# Altium schematic sheet 20A_3V3_EVB.SchDoc
size A4
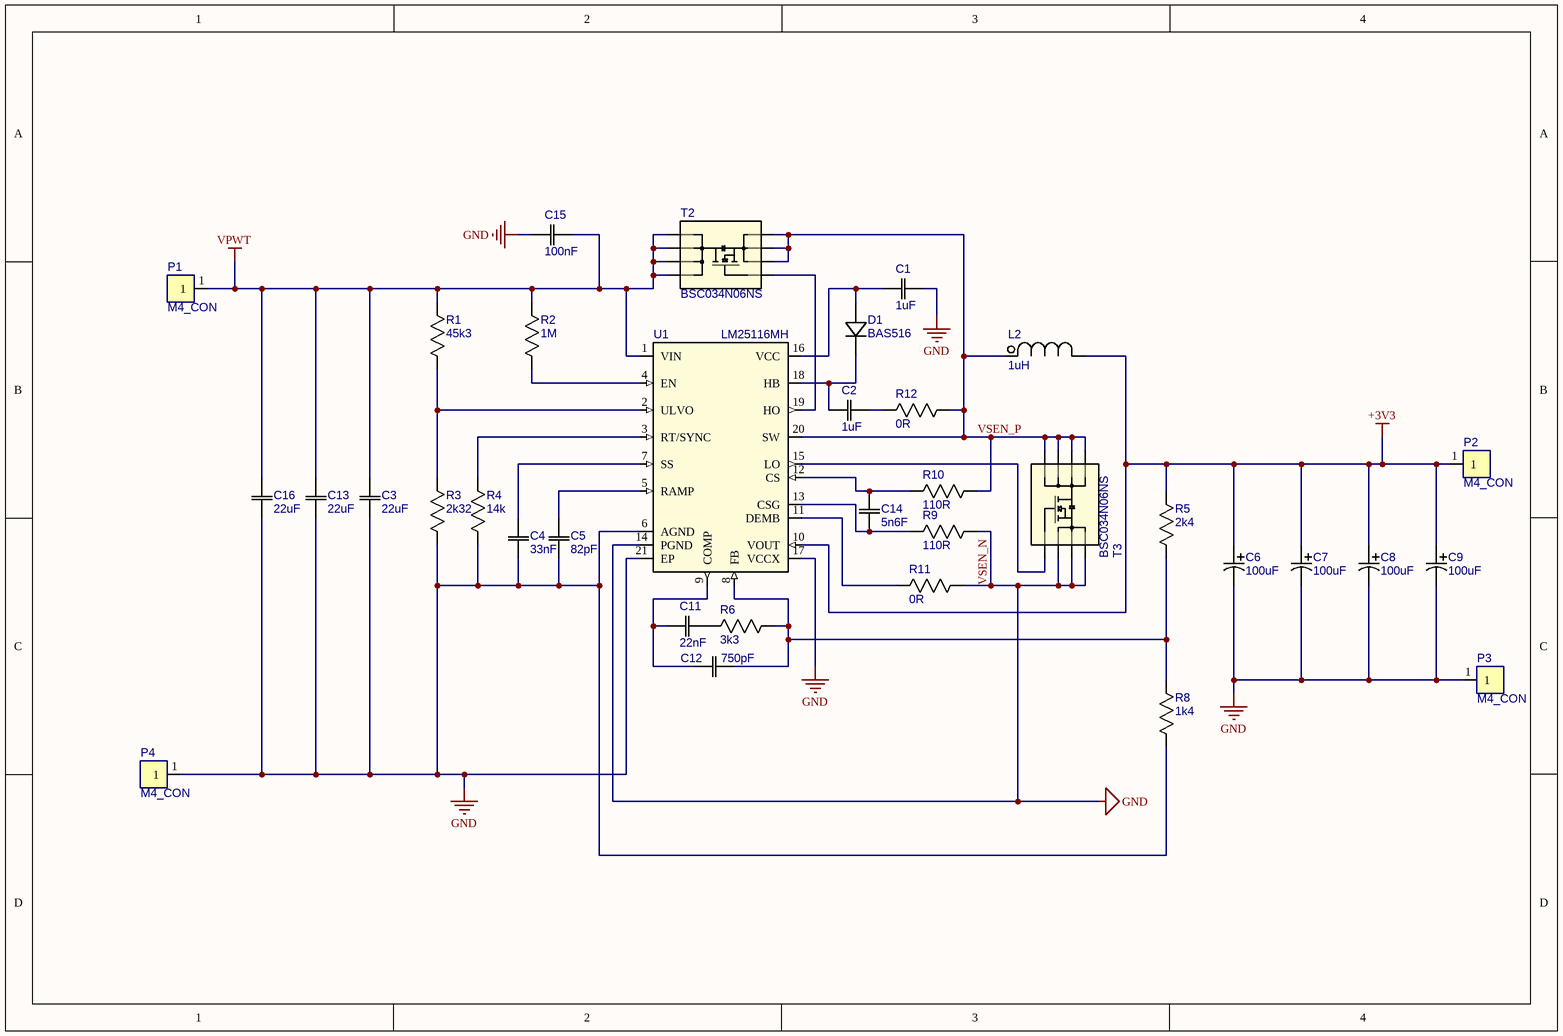
[diagram p0: 20A_3V3_EVB.SchDoc]

## Parts
C1  1uF  [C0603]
C2  1uF  [C0603]
C3  22uF  [1210]
C4  33nF  [0402]
C5  82pF  [0402]
C6  100uF  [3528]
C7  100uF  [3528]
C8  100uF  [3528]
C9  100uF  [3528]
C11  22nF  [0402]
C12  750pF  [CAP_CC0402_YAG]
C13  22uF  [1210]
C14  5n6F  [0402]
C15  100nF  [C0603]
C16  22uF  [1210]
D1  BAS516  [SOD-523]
L2  1uH  [XAL1010]
P1  M4_CON  [PCBComponent_1]
P2  M4_CON  [PCBComponent_1]
P3  M4_CON  [PCBComponent_1]
P4  M4_CON  [PCBComponent_1]
R1  45k3  [0402_PAN]
R2  1M  [0402]
R3  2k32  [0402_PAN]
R4  14k  [0402_PAN]
R5  2k4  [0402]
R6  3k3  [0402_PAN]
R8  1k4  [0402_PAN]
R9  110R  [0402_PAN]
R10  110R  [0402_PAN]
R11  0R  [0402]
R12  0R  [0402]
T2  BSC034N06NS  [PQFNWB5x6]
T3  BSC034N06NS  [PQFNWB5x6]
U1  LM25116MH  [20-HTSSOP]

## Nets
+3V3: C6.1 C7.1 C8.1 C9.1 L2.2 P2.1 R5.1 U1.10(VOUT)
VPWT: C3.2 C13.2 C15.1 C16.2 P1.1 R1.2 R2.2 T2.5 T2.6 T2.7 T2.8 U1.1(VIN)
VSEN_N: C1.1 C3.1 C4.1 C5.1 C6.2 C7.2 C8.2 C9.2 C13.1 C15.2 C16.1 P3.1 P4.1 R3.1 R4.1 R8.2 R9.2 R11.2 T3.1 T3.2 T3.3 U1.6(AGND) U1.14(PGND) U1.17(VCCX) U1.21(EP)  [also labelled GND]
VSEN_P: L2.1 R10.2 R12.2 T2.1 T2.2 T2.3 T3.5 T3.6 T3.7 T3.8 U1.20(SW)
NetC1_2: C1.2 D1.2 U1.16(VCC)
NetC2_1: C2.1 R12.1
NetC2_2: C2.2 D1.1 U1.18(HB)
NetC4_2: C4.2 U1.7(SS)
NetC5_2: C5.2 U1.5(RAMP)
NetC11_1: C11.1 R6.2
NetC11_2: C11.2 C12.2 U1.9(COMP)
NetC12_1: C12.1 R5.2 R6.1 R8.1 U1.8(FB)
NetC14_1: C14.1 R10.1 U1.12(CS)
NetC14_2: C14.2 R9.1 U1.13(CSG)
NetR1_1: R1.1 R3.2 U1.2(ULVO)
NetR2_1: R2.1 U1.4(EN)
NetR4_2: R4.2 U1.3(RT/SYNC)
NetR11_1: R11.1 U1.11(DEMB)
NetT2_4: T2.4 U1.19(HO)
NetT3_4: T3.4 U1.15(LO)

## Library data of the parts
C1 C2 = OUDEIBUN_1uF: 0603 1UF 16V 10% 105K X5R; Price: 0.03; ComponentLink1Description: taobao; ComponentLink1URL: https://detail.tmall.com/item.htm?abbucket=11&id=610883455002&rn=96f7b0dde361d4c3b62eb7ab1af2da05&skuId=4292434832790&spm=a1z10.3-b.w4011-22147617817.48.46817d1eD6aiZS; Mfr.: OUDEIBUN; Mfr. No: 105K
C3 C13 C16 = OUBEIDUN_226K_X7R_100V: 1210 22UF 226K 100V X7R; Mfr. No: 22uF/100V; ComponentLink1Description: taobao; ComponentLink1URL: https://detail.tmall.com/item.htm?abbucket=11&id=611466299848&rn=0b473a83d8464c2abde96b12f8b0e71f&skuId=4303396365636&spm=a1z10.3-b.w4011-22147617817.151.31717d1ewwcxVn; Mfr.: OUBEIDUN; Price: 1.2
C4 C11 = OBEIDUN_33nF: 0402 33nF 333K 16V X7R; ComponentLink1Description: taobao; ComponentLink1URL: https://detail.tmall.com/item.htm?abbucket=11&id=610643367827&rn=485ffb871bba3336ec56bdf6e40ebf1b&skuId=4293224337085&spm=a1z10.3-b.w4011-22147617817.69.91e77d1e9KkI7E; Mfr. No: 333K; Mfr.: OBEIDUN; Price: 0.03
C5 = taobao_82pF: 82pF 50V C0G CL05C820JB5NNNC; Mfr.: Samsung; ComponentLink1Description: taobao; ComponentLink1URL: https://item.taobao.com/item.htm?spm=a1z09.2.0.0.10c82e8dL5BzWq&id=619526874964&_u=l10quk0ka3f0; Mfr. No: CL05C820JB5NNNC; Price: 0.03
C6-C9 = 6TPE100MPB: 6TPE100MAZB 6.3V 100uF ESR 25mR; Mfr.: Auwah; Mfr. No: 6TPE100MAZB; Price: 1.0; ComponentLink1Description: taobao; ComponentLink1URL: https://detail.tmall.com/item.htm?id=608667689658&spm=a1z0d.6639537/tb2.1997196601.4.461a748465LZBL&skuId=4600334325022
C12 = GCM1555C1H330JA16J: Mfr.: Murata Electronics; ComponentLink1Description: mouser; ComponentLink1URL: https://www.mouser.hk/ProductDetail/Murata-Electronics/GCM1555C1H330JA16J?qs=hNud%2FORuBR35r9xfgxU5AA%3D%3D; Mfr. No: GCM1555C1H330JA16J
C14 = OBEIDUN_5n6F: 0402 562K 5.6NF 50V X7R; ComponentLink1Description: taobao; ComponentLink1URL: https://detail.tmall.com/item.htm?_u=i10quk0kb5ea&id=609907244741&spm=a1z09.2.0.0.485e2e8ddN1cee; Mfr. No: 562K; Mfr.: OBEIDUN; Price: 0.015
C15 = OUDEIBUN_100nF: 0603 100NF 50V 10% 104K X7R; Price: 0.025; ComponentLink1Description: taobao; ComponentLink1URL: https://detail.tmall.com/item.htm?_u=p10quk0k2f35&id=610651934672&spm=a1z09.2.0.0.77b12e8d9iVia0&skuId=4463522550238; Mfr.: OUDEIBUN; Mfr. No: 104K
D1 = OBEIDUN_BAS516: SOD-523 100V/250mA; Mfr. No: BAS516,61; ComponentLink1Description: taobao; ComponentLink1URL: https://detail.tmall.com/item.htm?abbucket=11&id=627344864030&rn=9e03fb0dc0c82be40d648479edaa9265&skuId=4457291933929&spm=a1z10.3-b.w4011-22147617817.46.572e7d1eRfO8kn; Mfr.: OBEIDUN; Price: 0.14
L2 = XAL1010-102MEB: 1uH Shld 20% 43.5A 1.1mOhms; Mfr.: Coilcraft; ComponentLink1Description: taobao; ComponentLink1URL: https://item.taobao.com/item.htm?spm=a1z09.2.0.0.2f012e8dsWfgWQ&id=647080730279&_u=o10quk0k0a39; Mfr. No: XAL1010-102; Price: 15.0
P1-P4 = M4_CON: Mfr.: LFX; Mfr. No: PCB-10-4; ComponentLink1Description: taobao; ComponentLink1URL: https://item.taobao.com/item.htm?spm=a1z09.2.0.0.45712e8dxvwLo5&id=531030902005&_u=s10quk0k994a; Price: 0.41
R1 R3 R8 = RC0402FR-070RL: RC0402FR-070RL / Thick Film Resistors - SMD 0 Ohms 62.5mW 0402 1%; Mfr.: YAGEO; ComponentLink1Description: mouser; ComponentLink1URL: https://www.mouser.hk/ProductDetail/YAGEO/RC0402FR-070RL?qs=sxZXDnvRBEhfSy4CZGX2ww%3D%3D; Mfr. No: RC0402FR-070RL
R2 = OUDEIBUN_1M: OUDEIBUN / 1% 1M; ComponentLink1Description: taobao; ComponentLink1URL: https://detail.tmall.com/item.htm?abbucket=11&id=608939673744&rn=c46e4f8982e6d7862a81dc35563fabd4&spm=a1z10.3-b.w4011-22147617817.102.75587d1etnNQON&skuId=4277313148184; Mfr. No: 1M; Mfr.: OUDEIBUN; Price: 0.02
R4 = RT0402FRE0715KL: RT0402FRE0715KL / SMD 1/16W 15K ohm 1% 50ppm; Mfr.: YAGEO; ComponentLink1Description: mouser; ComponentLink1URL: https://www.mouser.hk/ProductDetail/YAGEO/RT0402FRE0715KL?qs=BXCcY9r%252B08DJ61RmusQ2ew%3D%3D; Mfr. No: RT0402FRE0715KL
R5 = OUDEIBUN_2k4: OUDEIBUN / 1% 2k4; ComponentLink1Description: taobao; ComponentLink1URL: https://detail.tmall.com/item.htm?abbucket=13&id=608847085071&rn=5bc64e1df7efd0e1787ebbcda2a02caa&spm=a1z10.3-b.w4011-22147617817.41.43317d1e4BZXd6&skuId=4279724601891; Mfr. No: 2k4; Mfr.: OUDEIBUN; Price: 0.02
R6 = RC0402FR-0757K6L: Thick Film Resistors - SMD 57.6 kOhms 62.5mW 0402 1%; ComponentLink1Description: mouser; ComponentLink1URL: https://www.mouser.hk/ProductDetail/YAGEO/RC0402FR-0757K6L?qs=Is6ZsIPfHkYex3cihc3pCQ%3D%3D
R9 R10 = 0402WGF0000TCE: 0R ±1% 1/16W; Mfr.: UNIOHM; ComponentLink1Description: taobao; ComponentLink1URL: https://item.taobao.com/item.htm?spm=a1z10.3-c-s.w4002-24706531953.10.75da6a4bMSLHjB&id=605411575000; Mfr. No: 0R; Price: 0.012
R11 R12 = OUDEIBUN_0R: OUDEIBUN / 0R 1% 1/16W; ComponentLink1Description: taobao; ComponentLink1URL: https://detail.tmall.com/item.htm?abbucket=11&id=609078082053&rn=dd22835191e181ef543cf6f0827e8de3&spm=a1z10.3-b.w4011-22147617817.40.1e787d1eBkSpf5&skuId=4447040574382; Mfr.: OUDEIBUN; Mfr. No: 0R; Price: 0.02
T2 T3 = BSC034N06NS: MPower Transistor, 60V; Mfr.: Infineon Technologies; Mfr. No: BSC034N06NS; ComponentLink1Description: taobao; ComponentLink1URL: https://detail.tmall.com/item.htm?abbucket=12&id=712516353118&ns=1&spm=a21n57.1.0.0.5a70523ceCAuo0&skuId=4992670365636; Price: 4.5
U1 = LM25116MH: Switching Controllers WIDE RANGE SYNC BUCK CONTROLLER; Mfr.: Texas Instruments; Mfr. No: LM25116MH; ComponentLink1Description: mouser; ComponentLink1URL: https://www.mouser.hk/ProductDetail/Texas-Instruments/LM25116MH-NOPB?qs=X1J7HmVL2ZFRPxaLhhIUKg%3D%3D